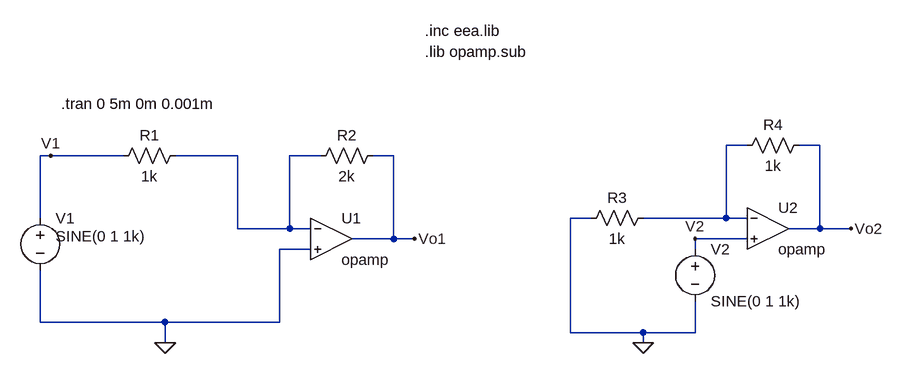
[diagram p0: schematic STI_TC1_Auto_3-Ampli-op.asc]
STI_TC1_Auto_3-Ampli-op.asc, the LTspice schematic file:
Version 4
SHEET 1 908 804
WIRE 688 480 656 480
WIRE 800 480 768 480
WIRE -384 496 -400 496
WIRE -272 496 -384 496
WIRE -96 496 -192 496
WIRE 32 496 -16 496
WIRE 144 496 112 496
WIRE -400 592 -400 496
WIRE 448 592 416 592
WIRE 656 592 656 480
WIRE 656 592 528 592
WIRE 688 592 656 592
WIRE -96 608 -96 496
WIRE -16 608 -16 496
WIRE -16 608 -96 608
WIRE 16 608 -16 608
WIRE 800 608 800 480
WIRE 800 608 752 608
WIRE 848 608 800 608
WIRE 144 624 144 496
WIRE 144 624 80 624
WIRE 176 624 144 624
WIRE 688 624 608 624
WIRE 16 640 -32 640
WIRE 608 640 608 624
WIRE -400 752 -400 672
WIRE -208 752 -400 752
WIRE -32 752 -32 640
WIRE -32 752 -208 752
WIRE 416 768 416 592
WIRE 528 768 416 768
WIRE 608 768 608 720
WIRE 608 768 528 768
WIRE -208 784 -208 752
WIRE 528 784 528 768
FLAG -208 784 0
FLAG 176 624 Vo1
FLAG 528 784 0
FLAG 848 608 Vo2
FLAG -384 496 V1
FLAG 608 624 V2
SYMBOL voltage -400 576 R0
WINDOW 3 24 44 Left 2
WINDOW 123 0 0 Left 0
WINDOW 39 0 0 Left 0
SYMATTR InstName V1
SYMATTR Value SINE(0 1 1k)
SYMBOL voltage 608 624 R0
WINDOW 123 0 0 Left 0
WINDOW 39 0 0 Left 0
SYMATTR InstName V2
SYMATTR Value SINE(0 1 1k)
SYMBOL res -176 480 R90
WINDOW 0 0 56 VBottom 2
WINDOW 3 32 56 VTop 2
SYMATTR InstName R1
SYMATTR Value 1k
SYMBOL res 128 480 R90
WINDOW 0 0 56 VBottom 2
WINDOW 3 32 56 VTop 2
SYMATTR InstName R2
SYMATTR Value 2k
SYMBOL res 432 608 R270
WINDOW 0 32 56 VTop 2
WINDOW 3 0 56 VBottom 2
SYMATTR InstName R3
SYMATTR Value 1k
SYMBOL res 672 496 R270
WINDOW 0 32 56 VTop 2
WINDOW 3 0 56 VBottom 2
SYMATTR InstName R4
SYMATTR Value 1k
SYMBOL OpAmps\\opamp 48 560 R0
SYMATTR InstName U1
SYMBOL OpAmps\\opamp 720 544 R0
SYMATTR InstName U2
TEXT 192 304 Left 2 !.inc eea.lib
TEXT -368 416 Left 2 !.tran 0 5m 0m 0.001m
TEXT 192 336 Left 2 !.lib opamp.sub

The netlist it stands for:
* STI_TC1_Auto_3-Ampli-op.asc
V1 V1 0 SINE(0 1 1k)
V2 V2 0 SINE(0 1 1k)
R1 N002 V1 1k
R2 Vo1 N002 2k
R3 0 N001 1k
R4 N001 Vo2 1k
XU1 N002 0 Vo1 opamp Aol=100K GBW=10Meg  ; pins invin noninvin out
XU2 N001 V2 Vo2 opamp Aol=100K GBW=10Meg  ; pins invin noninvin out
.inc eea.lib
.tran 0 5m 0m 0.001m
.lib opamp.sub
.backanno
.end

* Results of the author's LTspice run, read from the files saved beside the schematic
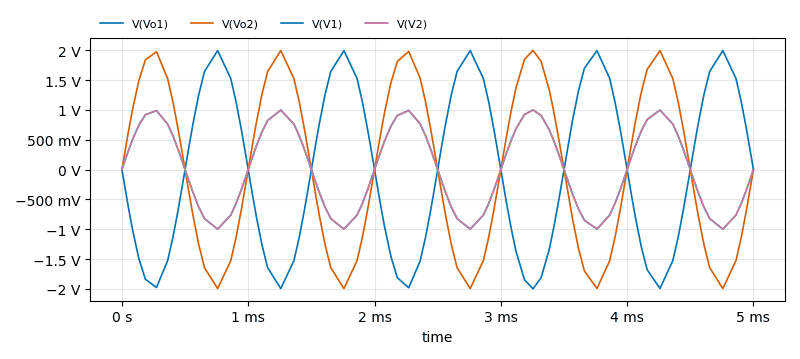
[diagram p1: Transient Analysis of STI_TC1_Auto_3-Ampli-op.asc, plotted from the saved traces]
* Transient Analysis, 1 run:
*   V(Vo1): min -1.999 V, max 1.995 V, average -3.32 mV, rms 1.389 V, last 600 µV
*   V(Vo2): min -1.995 V, max 1.999 V, average 3.32 mV, rms 1.389 V, last -400 µV
*   V(V1): min -997.7 mV, max 999.6 mV, average 1.66 mV, rms 694.5 mV, last 0 V
*   V(V2): min -997.7 mV, max 999.6 mV, average 1.66 mV, rms 694.5 mV, last 0 V